# EAGLE schematic main (EAGLE 9.6.2)

## Sheet 1 of 2
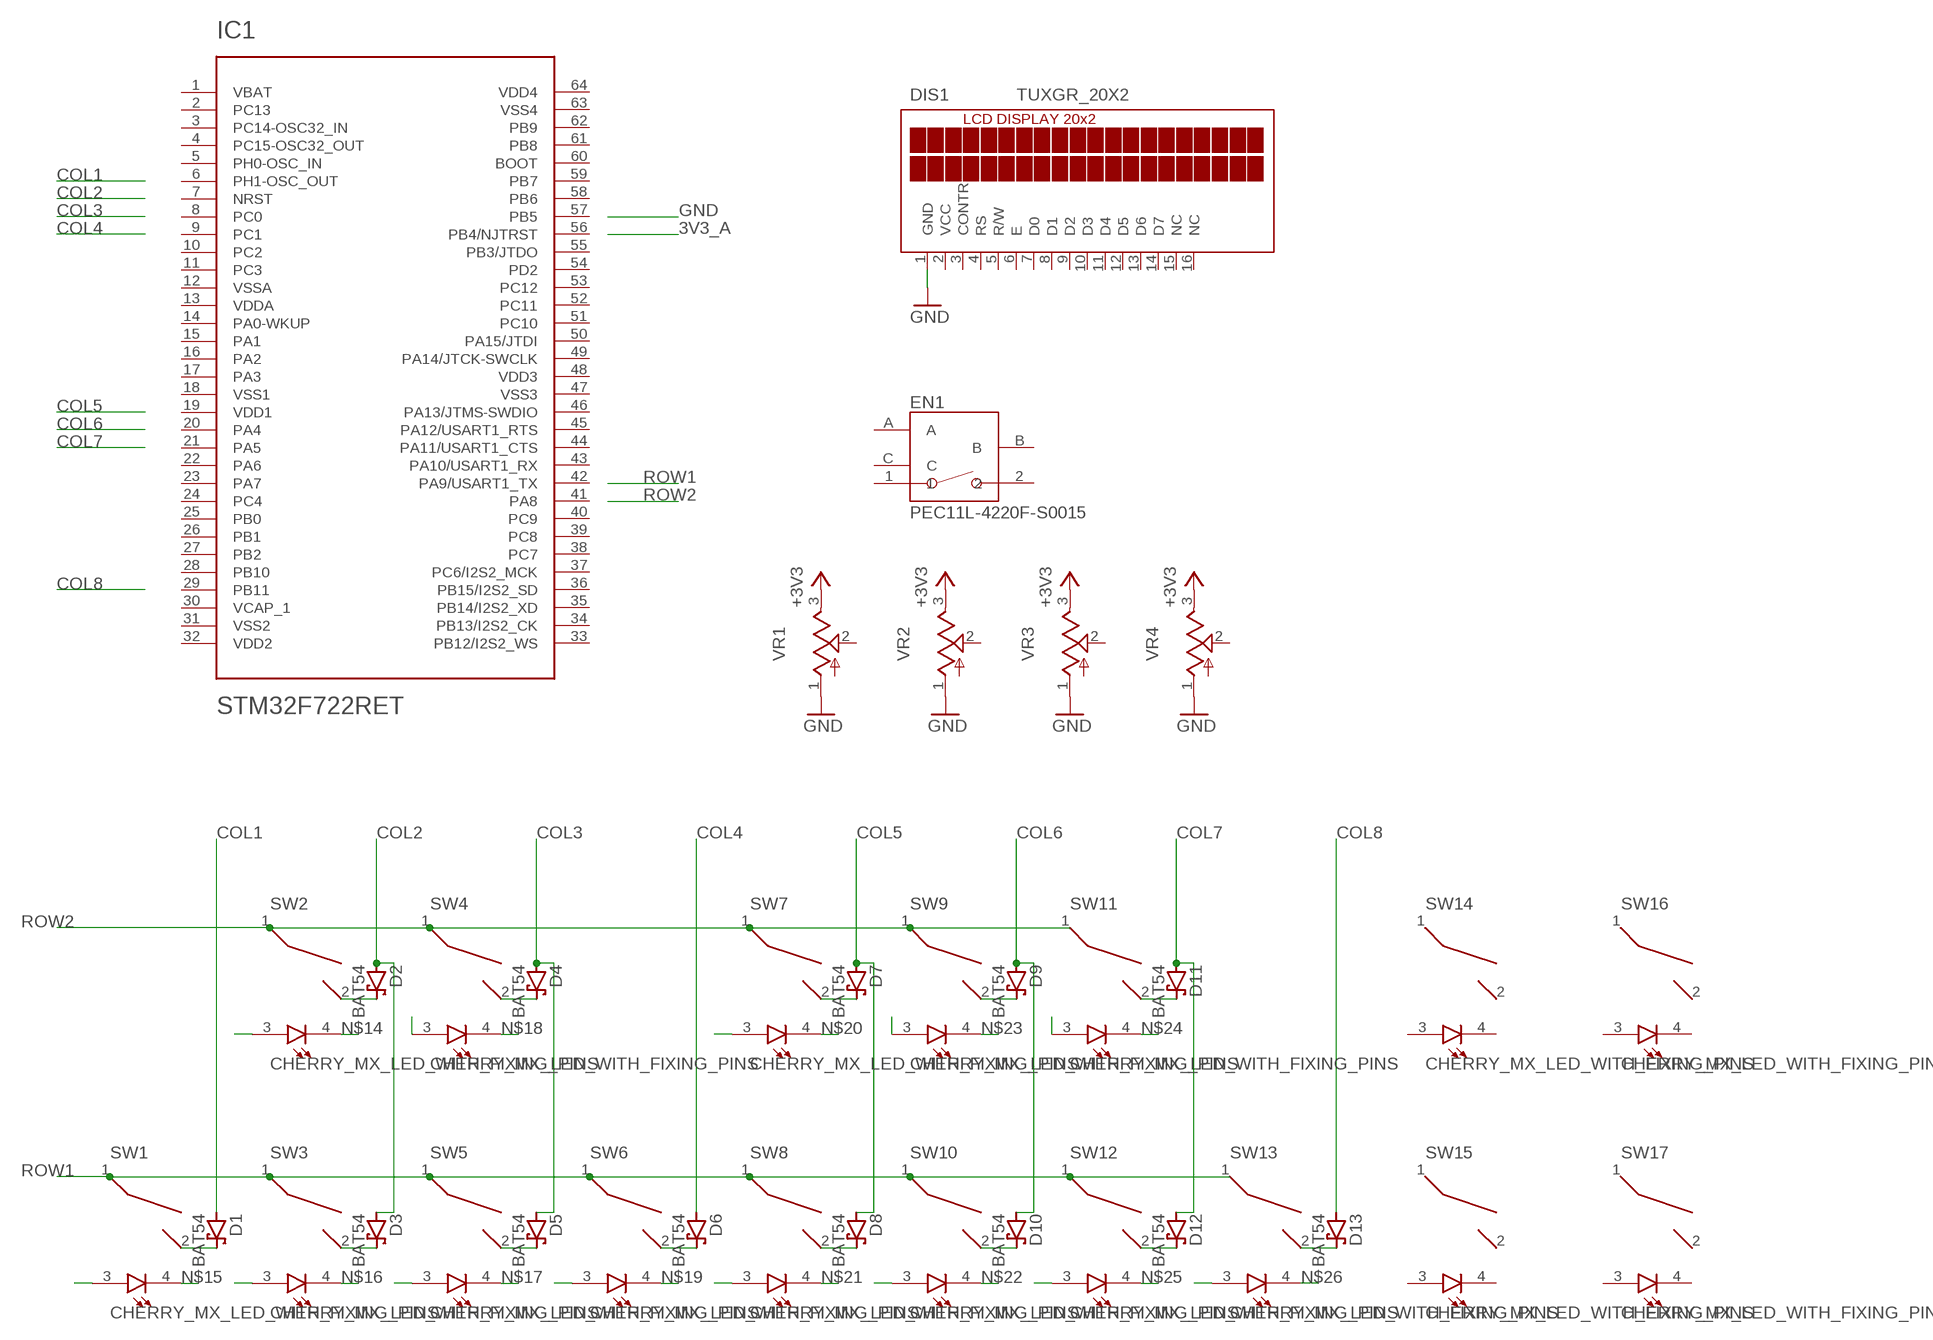
[diagram p0: schematic, sheet 1]

### Parts
D1  BAT54  [SOT23]
D2  BAT54  [SOT23]
D3  BAT54  [SOT23]
D4  BAT54  [SOT23]
D5  BAT54  [SOT23]
D6  BAT54  [SOT23]
D7  BAT54  [SOT23]
D8  BAT54  [SOT23]
D9  BAT54  [SOT23]
D10  BAT54  [SOT23]
D11  BAT54  [SOT23]
D12  BAT54  [SOT23]
D13  BAT54  [SOT23]
DIS1  TUXGR_20X2  [TUXGR_20X2]
EN1  PEC11L-4220F-S0015  [PEC11L-4220F-S0015]
IC1  STM32F722RET  [TQFP64]
SW1  CHERRY_MX_LED_WITH_FIXING_PINS  [MX1A-XX[R/G/Y]W]
SW2  CHERRY_MX_LED_WITH_FIXING_PINS  [MX1A-XX[R/G/Y]W]
SW3  CHERRY_MX_LED_WITH_FIXING_PINS  [MX1A-XX[R/G/Y]W]
SW4  CHERRY_MX_LED_WITH_FIXING_PINS  [MX1A-XX[R/G/Y]W]
SW5  CHERRY_MX_LED_WITH_FIXING_PINS  [MX1A-XX[R/G/Y]W]
SW6  CHERRY_MX_LED_WITH_FIXING_PINS  [MX1A-XX[R/G/Y]W]
SW7  CHERRY_MX_LED_WITH_FIXING_PINS  [MX1A-XX[R/G/Y]W]
SW8  CHERRY_MX_LED_WITH_FIXING_PINS  [MX1A-XX[R/G/Y]W]
SW9  CHERRY_MX_LED_WITH_FIXING_PINS  [MX1A-XX[R/G/Y]W]
SW10  CHERRY_MX_LED_WITH_FIXING_PINS  [MX1A-XX[R/G/Y]W]
SW11  CHERRY_MX_LED_WITH_FIXING_PINS  [MX1A-XX[R/G/Y]W]
SW12  CHERRY_MX_LED_WITH_FIXING_PINS  [MX1A-XX[R/G/Y]W]
SW13  CHERRY_MX_LED_WITH_FIXING_PINS  [MX1A-XX[R/G/Y]W]
SW14  CHERRY_MX_LED_WITH_FIXING_PINS  [MX1A-XX[R/G/Y]W]
SW15  CHERRY_MX_LED_WITH_FIXING_PINS  [MX1A-XX[R/G/Y]W]
SW16  CHERRY_MX_LED_WITH_FIXING_PINS  [MX1A-XX[R/G/Y]W]
SW17  CHERRY_MX_LED_WITH_FIXING_PINS  [MX1A-XX[R/G/Y]W]
VR1  9MM_V  [9MM_V]
VR2  9MM_V  [9MM_V]
VR3  9MM_V  [9MM_V]
VR4  9MM_V  [9MM_V]

### Nets
+3V3 [VCC]: VR1.3 VR2.3 VR3.3 VR4.3 ; also sheet 2
COL1: D1.1(A)
COL2: D2.1(A) D3.1(A)
COL3: D4.1(A) D5.1(A)
COL4: D6.1(A)
COL5: D7.1(A) D8.1(A)
COL6: D9.1(A) D10.1(A)
COL7: D11.1(A) D12.1(A)
COL8: D13.1(A)
GND [GND]: DIS1.1(GND) VR1.1 VR2.1 VR3.1 VR4.1 ; also sheet 2
N$1: D2.3(C) SW2.2
N$2: D4.3(C) SW4.2
N$3: D7.3(C) SW7.2
N$4: D9.3(C) SW9.2
N$5: D11.3(C) SW11.2
N$6: D1.3(C) SW1.2
N$7: D3.3(C) SW3.2
N$8: D5.3(C) SW5.2
N$9: D6.3(C) SW6.2
N$10: D8.3(C) SW8.2
N$11: D10.3(C) SW10.2
N$12: D12.3(C) SW12.2
N$13: D13.3(C) SW13.2
N$14: SW2.4
N$15: SW1.4
N$16: SW3.4
N$17: SW5.4
N$18: SW4.4
N$19: SW6.4
N$20: SW7.4
N$21: SW8.4
N$22: SW10.4
N$23: SW9.4
N$24: SW11.4
N$25: SW12.4
N$26: SW13.4
N$27: SW1.3
N$28: SW2.3
N$29: SW3.3
N$30: SW5.3
N$31: SW4.3
N$32: SW6.3
N$33: SW7.3
N$34: SW8.3
N$35: SW9.3
N$36: SW10.3
N$37: SW12.3
N$38: SW11.3
N$39: SW13.3
ROW1: SW1.1 SW3.1 SW5.1 SW6.1 SW8.1 SW10.1 SW12.1 SW13.1
ROW2: SW2.1 SW4.1 SW7.1 SW9.1 SW11.1
Unconnected: DIS1.3(CONTR) DIS1.4(RS) DIS1.5(R/W) DIS1.6(E) DIS1.7(D0) DIS1.8(D1) DIS1.9(D2) DIS1.10(D3) DIS1.11(D4) DIS1.12(D5) DIS1.13(D6) DIS1.14(D7) DIS1.15(NC) DIS1.16(NC) EN1.1 EN1.2 EN1.A EN1.B EN1.C IC1.1(VBAT) IC1.2(PC13) IC1.3(PC14-OSC32_IN) IC1.4(PC15-OSC32_OUT) IC1.5(PH0-OSC_IN) IC1.6(PH1-OSC_OUT) IC1.7(NRST) IC1.8(PC0) IC1.9(PC1) IC1.10(PC2) IC1.11(PC3) IC1.12(VSSA) IC1.13(VDDA) IC1.14(PA0-WKUP) IC1.15(PA1) IC1.16(PA2) IC1.17(PA3) IC1.18(VSS1) IC1.19(VDD1) IC1.20(PA4) IC1.21(PA5) IC1.22(PA6) IC1.23(PA7) IC1.24(PC4) IC1.25(PB0) IC1.26(PB1) IC1.27(PB2) IC1.28(PB10) IC1.29(PB11) IC1.30(VCAP_1) IC1.31(VSS2) IC1.32(VDD2) IC1.33(PB12/I2S2_WS) IC1.34(PB13/I2S2_CK) IC1.35(PB14/I2S2_XD) IC1.36(PB15/I2S2_SD) IC1.37(PC6/I2S2_MCK) IC1.38(PC7) IC1.39(PC8) IC1.40(PC9) IC1.41(PA8) IC1.42(PA9/USART1_TX) IC1.43(PA10/USART1_RX) IC1.44(PA11/USART1_CTS) IC1.45(PA12/USART1_RTS) IC1.46(PA13/JTMS-SWDIO) IC1.47(VSS3) IC1.48(VDD3) IC1.49(PA14/JTCK-SWCLK) IC1.50(PA15/JTDI) IC1.51(PC10) IC1.52(PC11) IC1.53(PC12) IC1.54(PD2) IC1.55(PB3/JTDO) IC1.56(PB4/NJTRST) IC1.57(PB5) IC1.58(PB6) IC1.59(PB7) IC1.60(BOOT) IC1.61(PB8) IC1.62(PB9) IC1.63(VSS4) IC1.64(VDD4) SW14.1 SW14.2 SW14.3 SW14.4 SW15.1 SW15.2 SW15.3 SW15.4 SW16.1 SW16.2 SW16.3 SW16.4 SW17.1 SW17.2 SW17.3 SW17.4 VR1.2 VR2.2 VR3.2 VR4.2

## Sheet 2 of 2
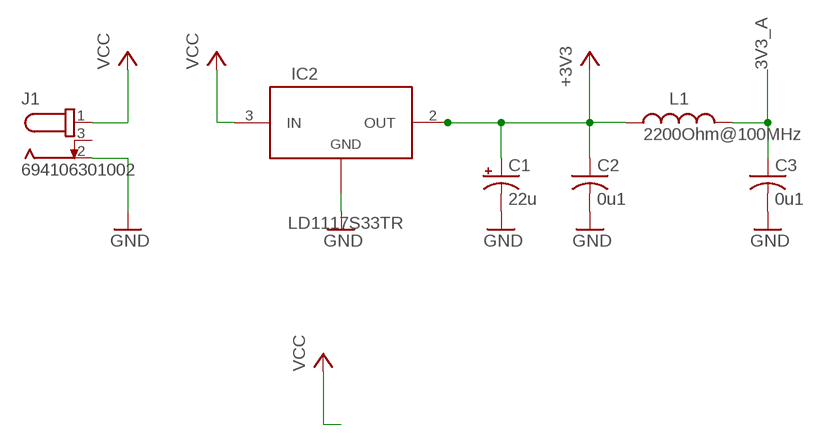
[diagram p1: schematic, sheet 2]

### Parts
C1  22u  CPOL-USC  [PANASONIC_C]
C2  0u1  C-USC0603  [C0603]
C3  0u1  C-USC0603  [C0603]
IC2  LD1117S33TR  [SOT-223]
J1  694106301002  [694106301002]
L1  2200Ohm@100MHz  WE-CBF_0603_742792693_WB_HS  [WE-CBF_0603(W=2.2)]

### Nets
3V3_A [VCC]: C3.1 L1.2 ; also sheet 1
+3V3 [VCC]: C1.+ C2.1 IC2.2(OUT) IC2.4 L1.1 ; also sheet 1
GND [GND]: C1.- C2.2 C3.2 IC2.1(ADJ/GND) J1.2 ; also sheet 1
VCC [VCC]: IC2.3(IN) J1.1
Unconnected: J1.3

## Power pins joined to a net without a drawn wire
VCC: DIS1.2(VCC)

## Library data of the parts
C1 = rcl:CPOL-US: POLARIZED CAPACITOR, American symbol; SPICEPREFIX: C
C2 C3 = rcl:C-US: CAPACITOR, American symbol; SPICEPREFIX: C
D1-D13 = diode:BAT54: Schottky Diodes Source: Fairchild .. BAT54.pdf
DIS1 = display-lcd:TUXGR_20X2: Tuxgraphics LCD display 20x2 characters reflective, without background light Source: tuxgr_20x2.pdf; OC_FARNELL: unknown; OC_NEWARK: unknown
EN1 = Encoders:PEC11L-4220F-S0015: ROTARY ENCODER MECHANICAL 15PPR Manufacturer's datasheet <https://www.bourns.com/docs/Product-Datasheets/PEC11L.pdf>; CREATED_BY: PCBLayout.com; DIGIKEY_PARTNO: PEC11L-4220F-S0015-ND; MANUFACTURER: Bourns Inc.; MPN: PEC11L-4220F-S0015
IC1 = og_microcontrollers:STM32F722RET
IC2 = IC:LD1117S33TR: IC REG LINEAR 3.3V 800MA SOT223 Manufacturer's datasheet <http://www.st.com/content/ccc/resource/technical/document/datasheet/99/3b/7d/91/91/51/4b/be/CD00000544.pdf/files/CD00000544.pdf/jcr:content/translations/en.CD00000544.pdf>; CREATED_BY: PCBLayout.com; DIGIKEY_PART_NUMBER: 497-1242-2-ND; MANUFACTURER: STMicroelectronics; MPN: LD1117S33TR; PACKAGE: SOT-223
J1 = DC Power Jacks:694106301002: CONN PWR JACK 2.1X5.5MM SOLDER Manufacturer's datasheet <https://katalog.we-online.de/em/datasheet/6941xx301002.pdf>; CREATED_BY: PCBLayout.com; DIGIKEY_PART_NUMBER: 732-5930-ND; MANUFACTURER: Wurth Electronics Inc.; MPN: 694106301002
L1 = Wurth_EMC Components_WE-CBF:WE-CBF_0603: WE-CBF SMD EMI Suppression Ferrite Bead Characteristics Reliable Ni-Sn electrodes High rated current up to 6 A Operating temperature: –55 ºC to +125 ºC Applications Perfect as data lined filter and for uncoupling of distribution voltage Package name and Variant abbreviation: Package: Wide Band /High Speed: W=Width= 2.2 High Current: W=Width= 2.6 Variant abbreviation: WB = Wide Band HS=High Speed HC=High Current <https://katalog.we-online.de/media/images/v2/o14753v209%20Family_WE-CBF.jpg> Details see: http://katalog.we-online.de/en/pbs/WE-CBF Updated by Ella Wu 2019-01-02 2019 (C) Wurth Elektronik; DATASHEET-URL: https://www.we-online.com/catalog/datasheet/742792693.pdf; IR1: 50mA; IR2: 500mA; MOUNT: SMT; PART-NUMBER: 742792693; RDC-MAX: 0.8Ohm; TYPE: Wide Band; Z: 192Ohm@1GMHz; ZMAX: 2250Ohm
SW1-SW17 = og_cherry_mx:CHERRY_MX_LED
VR1-VR4 = og_pot:9MM_V

## Net classes
1 GND: width 0.305 mm
2 VCC: width 0.305 mm